# Altium project smart generator controller.PrjPcb (part 2 of 2)
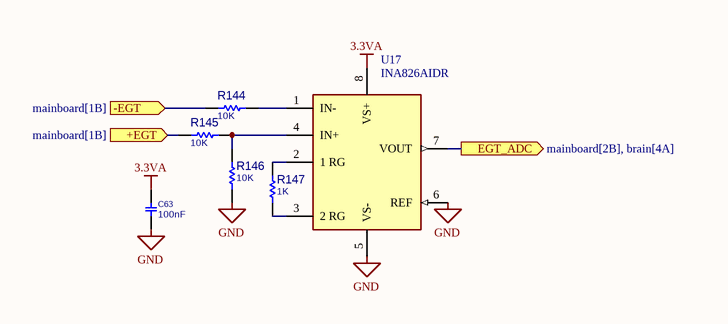
[diagram p8: exhaust_gas_temp_oxy.SchDoc]

## Nets that join several sheets
3.3V: etb_driver (R32.2 R33.2 U8.13 U9.13), power (C15.2 C16.2 FB3.2 U7.4), brain (16 pins)
3.3VA: power (C17.2 C18.2 FB3.1 R31.2), brain (C35.2 C36.2 U11.13), exhaust_gas_temp_oxy (C63.2 U17.8)
5V: power (5 pins), coil_inj_drivers (8 pins), brain (D20.2), trigger_interface (14 pins), output_drivers (C61.2 C62.2 U15.6 U16.6)
5VA: mainboard (J4.6 J4.7), power (C11.2 C12.2 FB2.1 R29.2), brain (9 pins)
GND: mainboard (8 pins), etb_driver (28 pins), power (22 pins), coil_inj_drivers (40 pins), brain (72 pins), trigger_interface (14 pins), output_drivers (24 pins), exhaust_gas_temp_oxy (C63.1 R146.1 U17.5 U17.6)
VBAT: etb_driver (16 pins), power (5 pins), coil_inj_drivers (D1.2 D2.2 D3.2 D4.2), brain (R63.2), output_drivers (5 pins)
+EGT: mainboard (J4.5), exhaust_gas_temp_oxy (R145.1)
-EGT: mainboard (J4.4), exhaust_gas_temp_oxy (R144.2)
ANALOG-INPUT-1: mainboard (J6.9), brain (R77.2 R79.1)
ANALOG-INPUT-2: mainboard (J6.10), brain (R81.2 R83.1)
AUX_RELAY_OUT: mainboard (J5.8), output_drivers (Q15.13)
CLT-SENSOR: mainboard (J6.7), brain (R64.1 R65.2)
DBW1_MOTOR1: mainboard (J3.2), etb_driver (U8.6 U8.7)
DBW1_MOTOR2: mainboard (J3.1), etb_driver (U8.14 U8.15)
DBW2_MOTOR1: mainboard (J3.4), etb_driver (U9.6 U9.7)
DBW2_MOTOR2: mainboard (J3.3), etb_driver (U9.14 U9.15)
ETB-1-SENSOR-1: mainboard (J6.1), brain (R34.2 R36.1)
ETB-1-SENSOR-2: mainboard (J6.2), brain (R38.2 R40.1)
ETB-2-SENSOR-1: mainboard (J6.3), brain (R42.2 R44.1)
ETB-2-SENSOR-2: mainboard (J6.4), brain (R47.2 R49.1)
FUEL_PUMP_RELAY_OUT: mainboard (J5.6), output_drivers (Q15.15)
GAS_SOLENOID_RELAY_OUT: mainboard (J5.7), output_drivers (Q15.14)
HP_LOW_SIDE_OUT_4: mainboard (J5.4), output_drivers (D26.1 Q19.4)
HP_LOWSIDE_PWM_1: mainboard (J5.3), output_drivers (D25.1 Q18.4)
HP_LOWSIDE_PWM_2: mainboard (J5.2), output_drivers (D24.1 Q17.4)
HP_LOWSIDE_PWM_3: mainboard (J5.1), output_drivers (D23.1 Q16.4)
IAT-SENSOR: mainboard (J6.6), brain (R58.1 R59.2)
IGN OUT 1: mainboard (J2.1), coil_inj_drivers (Q1.4 Q2.4)
IGN OUT 2: mainboard (J2.2), coil_inj_drivers (Q3.4 Q4.4)
IGN OUT 3: mainboard (J2.3), coil_inj_drivers (Q5.4 Q6.4)
IGN OUT 4: mainboard (J2.4), coil_inj_drivers (Q7.4 Q8.4)
INJ OUT 1: mainboard (J2.5), coil_inj_drivers (D1.1 T1.4)
INJ OUT 2: mainboard (J2.6), coil_inj_drivers (D2.1 T2.4)
INJ OUT 3: mainboard (J2.7), coil_inj_drivers (D3.1 T3.4)
INJ OUT 4: mainboard (J2.8), coil_inj_drivers (D4.1 T4.4)
LP_LOW_SIDE_OUT_1: mainboard (J5.9), output_drivers (Q15.12)
LP_LOW_SIDE_OUT_2: mainboard (J5.10), output_drivers (Q15.11)
MAIN_RELAY_OUT: mainboard (J5.5), output_drivers (Q15.16)
MAP-SENSOR: mainboard (J6.5), brain (R53.2 R56.1)
NetF2_1: mainboard (J1.5 J1.6), power (F2.1)
NetQ15_1: brain (U11.36), output_drivers (Q15.1 R125.2)
NetQ15_2: brain (U11.35), output_drivers (Q15.2 R126.2)
NetQ15_3: brain (U11.34), output_drivers (Q15.3 R127.2)
NetQ15_4: brain (U11.33), output_drivers (Q15.4 R128.2)
NetQ15_5: brain (U11.28), output_drivers (Q15.5 R129.2)
NetQ15_6: brain (U11.27), output_drivers (Q15.6 R130.2)
NetQ15_7: brain (U11.26), output_drivers (Q15.7 R131.2)
NetR5_2: coil_inj_drivers (R5.2 U1.4), brain (U11.56)
NetR6_2: coil_inj_drivers (R6.2 U1.2), brain (U11.57)
NetR7_2: coil_inj_drivers (R7.2 U2.4), brain (U11.52)
NetR8_2: coil_inj_drivers (R8.2 U2.2), brain (U11.53)
NetR13_2: coil_inj_drivers (R13.2 U3.4), brain (U11.54)
NetR14_2: coil_inj_drivers (R14.2 U3.2), brain (U11.55)
NetR15_2: coil_inj_drivers (R15.2 U4.4), brain (U11.50)
NetR16_2: coil_inj_drivers (R16.2 U4.2), brain (U11.51)
NetR99_2: brain (U11.61), trigger_interface (R99.2 R101.2)
NetR115_2: brain (U11.62), trigger_interface (R115.2 R117.2)
NetR136_2: brain (U11.42), output_drivers (R136.2 U15.4)
NetR137_2: brain (U11.43), output_drivers (R137.2 U15.2)
NetR141_2: brain (U11.29), output_drivers (R141.2 U16.4)
NetR142_2: brain (U11.41), output_drivers (R142.2 U16.2)
NetU8_3: etb_driver (U8.3), brain (U11.39)
NetU8_19: etb_driver (U8.19), brain (U11.40)
NetU9_3: etb_driver (U9.3), brain (U11.37)
NetU9_19: etb_driver (U9.19), brain (U11.38)
NetU11_8: brain (U11.8), exhaust_gas_temp_oxy (U17.7)
OIL-SENSOR: mainboard (J6.8), brain (R73.1 R74.2)
VR_SENSOR_1: mainboard (J4.1), trigger_interface (R106.2)
VR_SENSOR_2: mainboard (J4.2), trigger_interface (R122.2)